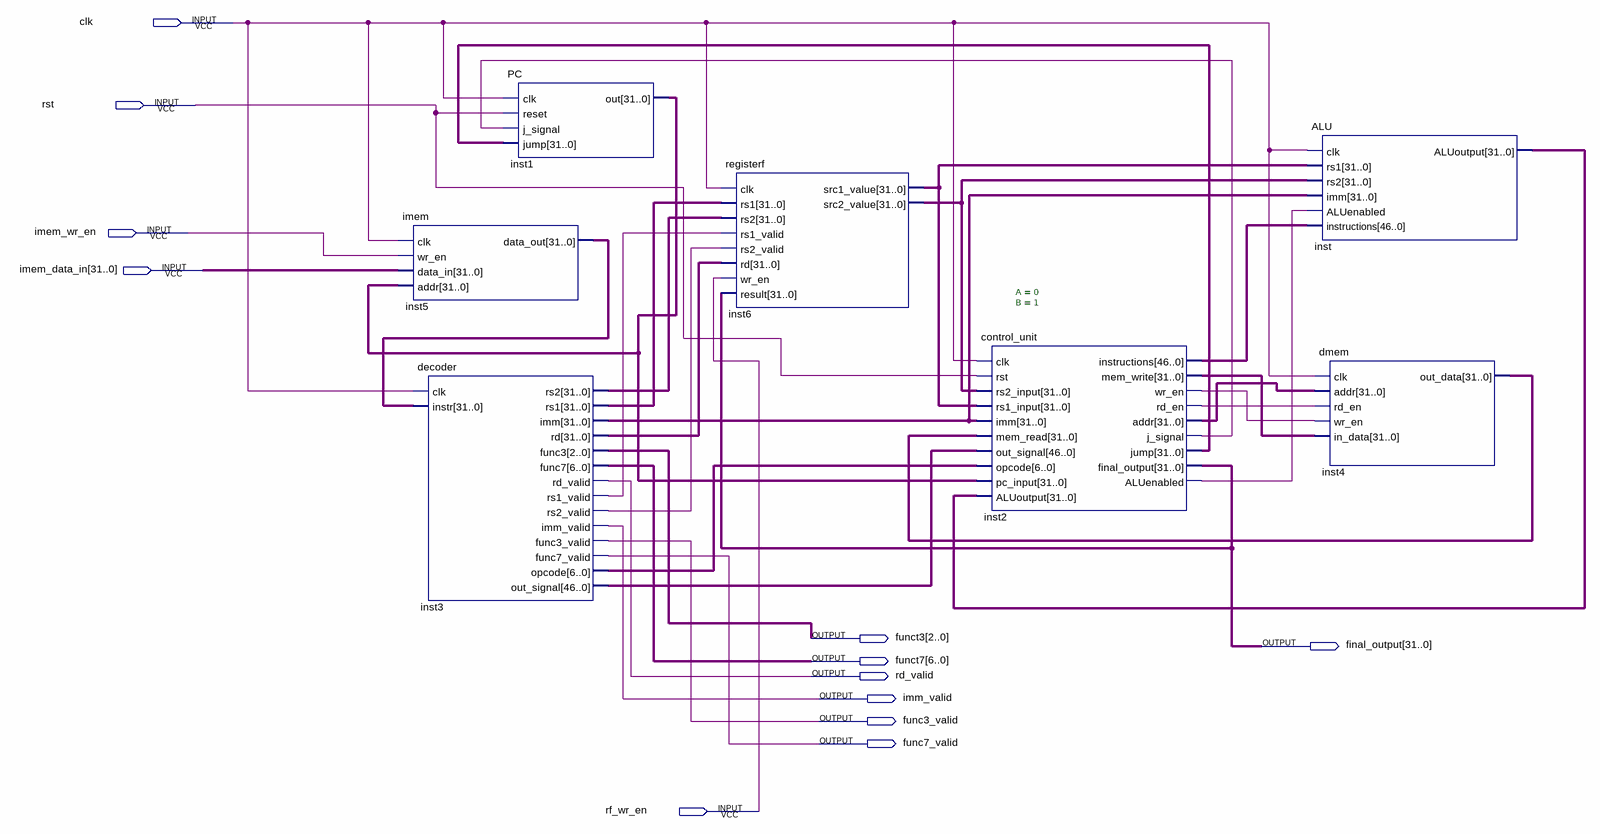
[diagram p0: schematic sheet]
// Quartus schematic risc_v.bdf as structural Verilog: 7 symbols, 12 pins
module risc_v (
  input  clk,
  input  rst,
  input  imem_wr_en,
  input  [31:0] imem_data_in,
  input  rf_wr_en,
  output [2:0] funct3,
  output [31:0] final_output,
  output [6:0] funct7,
  output rd_valid,
  output imm_valid,
  output func3_valid,
  output func7_valid
);

  wire inst2_aluenabled, inst2_j_signal, inst2_rd_en, inst2_wr_en, inst3_rs1_valid, inst3_rs2_valid;
  wire [6:0] inst3_opcode;
  wire [31:0] inst1_out, inst2_addr, inst2_jump, inst2_mem_write, inst3_imm, inst3_rd, inst3_rs1, inst3_rs2,
       inst4_out_data, inst5_data_out, inst6_src1_value, inst6_src2_value, inst_aluoutput;
  wire [46:0] inst2_instructions, inst3_out_signal;

  imem inst5 (.clk(clk), .wr_en(imem_wr_en), .data_in(imem_data_in), .addr(inst1_out), .data_out(inst5_data_out));
  decoder inst3 (
    .clk(clk), .instr(inst5_data_out), .rs2(inst3_rs2), .rs1(inst3_rs1), .imm(inst3_imm), .rd(inst3_rd),
    .func3(funct3), .func7(funct7), .rd_valid(rd_valid), .rs1_valid(inst3_rs1_valid),
    .rs2_valid(inst3_rs2_valid), .imm_valid(imm_valid), .func3_valid(func3_valid), .func7_valid(func7_valid),
    .opcode(inst3_opcode), .out_signal(inst3_out_signal));
  PC inst1 (.clk(clk), .reset(rst), .j_signal(inst2_j_signal), .jump(inst2_jump), .out(inst1_out));
  registerf inst6 (
    .clk(clk), .rs1(inst3_rs1), .rs2(inst3_rs2), .rs1_valid(inst3_rs1_valid), .rs2_valid(inst3_rs2_valid),
    .rd(inst3_rd), .wr_en(rf_wr_en), .result(final_output), .src1_value(inst6_src1_value),
    .src2_value(inst6_src2_value));
  control_unit #(.A(0), .B(1)) inst2 (
    .clk(clk), .rst(rst), .rs2_input(inst6_src2_value), .rs1_input(inst6_src1_value), .imm(inst3_imm),
    .mem_read(inst4_out_data), .out_signal(inst3_out_signal), .opcode(inst3_opcode), .pc_input(inst1_out),
    .ALUoutput(inst_aluoutput), .instructions(inst2_instructions), .mem_write(inst2_mem_write),
    .wr_en(inst2_wr_en), .rd_en(inst2_rd_en), .addr(inst2_addr), .j_signal(inst2_j_signal),
    .jump(inst2_jump), .final_output(final_output), .ALUenabled(inst2_aluenabled));
  ALU inst (
    .clk(clk), .rs1(inst6_src1_value), .rs2(inst6_src2_value), .imm(inst3_imm),
    .ALUenabled(inst2_aluenabled), .instructions(inst2_instructions), .ALUoutput(inst_aluoutput));
  dmem inst4 (
    .clk(clk), .addr(inst2_addr), .rd_en(inst2_rd_en), .wr_en(inst2_wr_en), .in_data(inst2_mem_write),
    .out_data(inst4_out_data));
endmodule
